# Altium schematic sheet AIRZAI_NFC_READER_FLEX.SchDoc
size A3
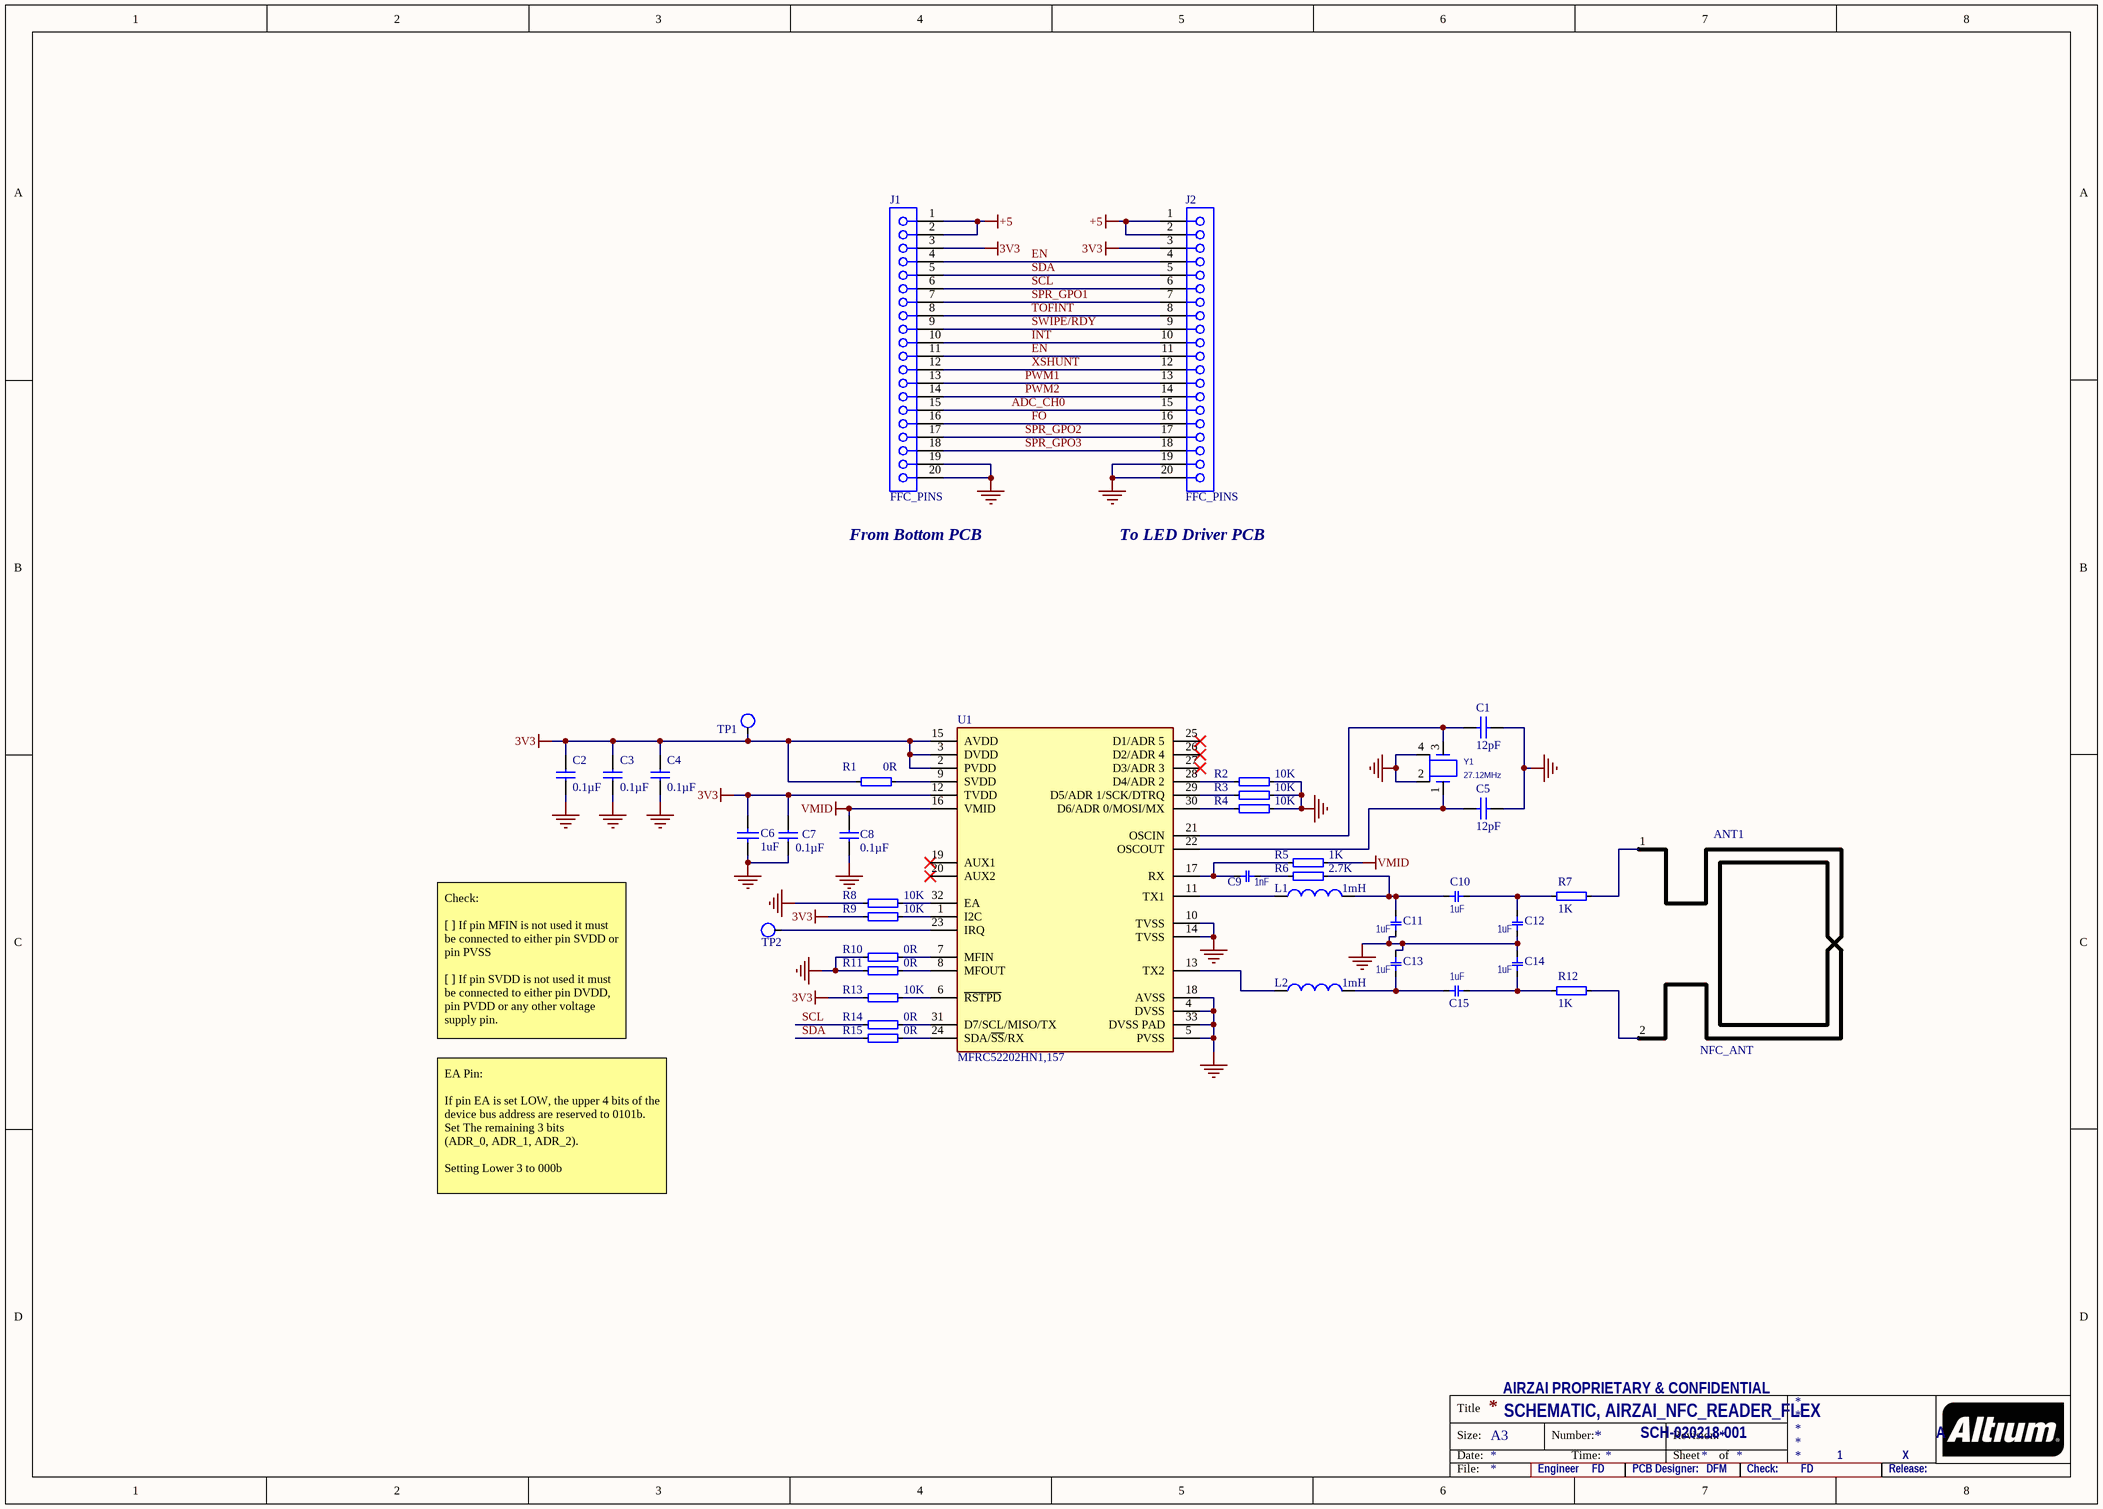
[diagram p0: AIRZAI_NFC_READER_FLEX.SchDoc]

## Parts
ANT1  NFC_ANT
C1  12pF
C2  0.1µF  [0402CAP]
C3  0.1µF  [0402CAP]
C4  0.1µF  [0402CAP]
C5  12pF
C6  1uF  [CAPC0402(1005)60_M]
C7  0.1µF  [0402CAP]
C8  0.1µF  [0402CAP]
C9  1nF  [0603]
C10  1uF  [0603]
C11  1uF  [0603]
C12  1uF  [0603]
C13  1uF  [0603]
C14  1uF  [0603]
C15  1uF  [0603]
J1  FFC_PINS
J2  FFC_PINS
L1  1mH  [0402-A]
L2  1mH  [0402-A]
R1  0R  [0402]
R2  10K  [0402]
R3  10K  [0402]
R4  10K  [0402]
R5  1K  [0402]
R6  2.7K  [0402]
R7  1K
R8  10K  [0402]
R9  10K  [0402]
R10  0R  [0402]
R11  0R  [0402]
R12  1K
R13  10K  [0402]
R14  0R  [0402]
R15  0R  [0402]
TP1  WIREPT  [TP_0.9MM]  (value not drawn)
TP2  WIREPT  [TP_0.9MM]  (value not drawn)
U1  Part Number: MFRC52202HN1,157  [NXP_SOT617-1_0]  (hidden comment: MFRC52201HN1,157)
Y1  27.12MHz  [XTAL_2016]

## Nets
3V3: C2.1 C3.1 C4.1 C6.2 C7.1 J1.3 J2.3 R1.2 R9.2 R13.2 TP1.1 U1.2(PVDD) U1.3(DVDD) U1.12(TVDD) U1.15(AVDD)
+5: J1.1 J1.2 J2.1 J2.2
GND: C1.1 C2.2 C3.2 C4.2 C5.1 C6.1 C7.2 C8.2 C11.1 C12.1 C13.2 C14.2 J1.19 J1.20 J2.19 J2.20 R2.1 R3.1 R4.1 R8.2 R10.2 R11.2 U1.4(DVSS) U1.5(PVSS) U1.10(TVSS) U1.14(TVSS) U1.18(AVSS) U1.33(DVSS_PAD) Y1.2 Y1.4
VMID: C8.1 R5.1 U1.16(VMID)
ADC_CH0: J1.15 J2.15
EN: J1.4 J1.11 J2.4 J2.11
FO: J1.16 J2.16
INT: J1.10 J2.10
PWM1: J1.13 J2.13
PWM2: J1.14 J2.14
SCL: J1.6 J2.6 R14.2
SDA: J1.5 J2.5 R15.2
SPR_GPO1: J1.7 J2.7
SPR_GPO2: J1.17 J2.17
SPR_GPO3: J1.18 J2.18
SWIPE/RDY: J1.9 J2.9
TOFINT: J1.8 J2.8
XSHUNT: J1.12 J2.12
NetANT1_1: ANT1.1 R7.1
NetANT1_2: ANT1.2 R12.1
NetC1_2: C1.2 U1.21(OSCIN) Y1.3
NetC5_2: C5.2 U1.22(OSCOUT) Y1.1
NetC9_1: C9.1 R6.2
NetC9_2: C9.2 R5.2 U1.17(RX)
NetC10_1: C10.1 C12.2 R7.2
NetC10_2: C10.2 C11.2 L1.2 R6.1
NetC13_1: C13.1 C15.2 L2.2
NetC14_1: C14.1 C15.1 R12.2
NetL1_1: L1.1 U1.11(TX1)
NetL2_1: L2.1 U1.13(TX2)
NetR1_1: R1.1 U1.9(SVDD)
NetR2_2: R2.2 U1.28(D4/ADR_2)
NetR3_2: R3.2 U1.29(D5/ADR_1/SCK/DTRQ)
NetR4_2: R4.2 U1.30(D6/ADR_0/MOSI/MX)
NetR8_1: R8.1 U1.32(EA)
NetR9_1: R9.1 U1.1(I2C)
NetR10_1: R10.1 U1.7(MFIN)
NetR11_1: R11.1 U1.8(MFOUT)
NetR13_1: R13.1 U1.6(~{RSTPD})
NetR14_1: R14.1 U1.31(D7/SCL/MISO/TX)
NetR15_1: R15.1 U1.24(SDA/~{SS}/RX)
NetTP2_1: TP2.1 U1.23(IRQ)

Not connected (* = marked no-connect by the designer): U1 19(AUX1)* 20(AUX2)* 25(D1/ADR_5)* 26(D2/ADR_4)* 27(D3/ADR_3)*

## Notes on the sheet
- (near J1) From Bottom PCB
- (near J2) To LED Driver PCB
- Check:
  [ ] If pin MFIN is not used it must be connected to either pin SVDD or pin PVSS
  [ ] If pin SVDD is not used it must be connected to either pin DVDD, pin PVDD or any other voltage supply pin.
- EA Pin:
  If pin EA is set LOW, the upper 4 bits of the device bus address are reserved to 0101b. Set The remaining 3 bits
  (ADR_0, ADR_1, ADR_2).
  Setting Lower 3 to 000b
- AIRZAI PROPRIETARY & CONFIDENTIAL
- SCHEMATIC, AIRZAI_NFC_READER_FLEX
- SCH-020218-001
- 1
- X
- A
- Engineer
- FD
- PCB Designer:
- DFM
- Check:
- Release:
- Title
- Size:
- Date:
- A3
- Number:
- Time:
- Revision:
- Sheet
- of
- File:

## Library data of the parts
C1 C5 = CAP: CAP CER 12PF 50V C0G/NP0 0402; Manufacturer: KEMET; Manufacturer Part Number: C0402C120J5GACTU; Dielectric Material: Ceramic; Tolerance: 5%; Dielectric: C0G; Temperature Coefficient: 30ppm/°C; Value: 12pF; ComponentLink1URL: https://www.yuden.co.jp/productdata/catalog/mlcc01_e.pdf?src-supplier=Digi-Key; ComponentLink1Description: https://www.yuden.co.jp/productdata/catalog/mlcc01_e.pdf?src-supplier=Digi-Key; ComponentLink2URL: http://www.onlinecomponents.com/productFiles/mf-TAI/964emk105bj105kv-f.pdf?src-supplier=Onlinecomponents.com; ComponentLink2Description: http://www.onlinecomponents.com/productFiles/mf-TAI/964emk105bj105kv-f.pdf?src-supplier=Onlinecomponents.com; ComponentLink3URL: http://www.farnell.com/datasheets/2091854.pdf?src-supplier=Element14; ComponentLink3Description: http://www.farnell.com/datasheets/2091854.pdf?src-supplier=Element14; ComponentLink4URL: https://www.verical.com/server-webapp/html/getDatasheet?partID=638287&src-supplier=Verical; ComponentLink4Description: https://www.verical.com/server-webapp/html/getDatasheet?partID=638287&src-supplier=Verical; ComponentLink5URL: http://ds.yuden.co.jp/TYCOMPAS/ut/detail.do?productNo=EMK105BJ105KV-F&fileName=EMK105BJ105KV-F_SS&mode=specSheetDownload&src-supplier=Mouser; ComponentLink5Description: http://ds.yuden.co.jp/TYCOMPAS/ut/detail.do?productNo=EMK105BJ105KV-F&fileName=EMK105BJ105KV-F_SS&mode=specSheetDownload&src-supplier=Mouser; ComponentLink6URL: http://www.farnell.com/datasheets/1497285.pdf?src-supplier=Element14; ComponentLink6Description: http://www.farnell.com/datasheets/1497285.pdf?src-supplier=Element14; Supplier 1: Digi-Key; Supplier Part Number 1: 399-1013-6-ND; Stock 1: 1653435; Pricing 1: 1=0.1, 10=0.055, 100=0.0243, 500=0.01738, 1000=0.01366, 2500=0.01242, 5000=0.01143 (USD); Mount: Surface Mount,PCB; Case/Package: 0402; Number of Pins: 2; Case Code (Metric): 1005; Case Code (Imperial): 0402; Min Operating Temperature: -55°C; Max Operating Temperature: 125°C; Capacitance: 12pF; Voltage Rating: 50V; Voltage Rating (DC): 50V; Packaging: Tape and Reel; Package Quantity: 1; Termination: SMD/SMT; Voltage: 50V; Length: 1mm; Height: 0.5mm; Width: 0.02inch; Thickness: 0.022inch; Lead Pitch: 0.3mm; Depth: 0.5mm; Radiation Hardening: No; REACH SVHC: No SVHC; Lead Free: Lead Free; ComponentLink7URL: http://www.farnell.com/datasheets/2119935.pdf?src-supplier=Element14; ComponentLink7Description: http://www.farnell.com/datasheets/2119935.pdf?src-supplier=Element14; ComponentLink8URL: http://www.farnell.com/datasheets/2740746.pdf?src-supplier=Newark; ComponentLink8Description: http://www.farnell.com/datasheets/2740746.pdf?src-supplier=Newark; ComponentLink9URL: http://www.mouser.com/ds/2/212/KEM_C1003_C0G_SMD-1101588.pdf?src-supplier=Mouser; ComponentLink9Description: http://www.mouser.com/ds/2/212/KEM_C1003_C0G_SMD-1101588.pdf?src-supplier=Mouser; ComponentLink10URL: https://www.alliedelec.com/m/d/9bfe7773041ffe9d406e68bc7b377fdd.pdf?src-supplier=Allied+Electronics; ComponentLink10Description: https://www.alliedelec.com/m/d/9bfe7773041ffe9d406e68bc7b377fdd.pdf?src-supplier=Allied+Electronics
C2-C4 C7 C8 = C0402-100n: Capacitor, X7R, ±10%; Manufacturer: TDK; Manufacturer Part Number: C1005X7R1C104K; Note: 16V ±10% X7R; Case-EIA: 0402; Case-Metric: 1005; Rated Voltage: 16 V; Tolerance: Â±20%; Datasheet: *; Footprint: 0402; Pin Count: 2; Value: 0.1µF; Supplier: *; Supplier part number: *; 2nd source Supplier: *; 2nd source part number: *; Max Thickness: 0.6 mm; Supplier 1: Digi-Key; Supplier Part Number 1: 445-4952-2-ND; Technology: SMT
C6 = CAP: CAP 1uF 16V ±10% 0402 (1005 Metric) Thickness 0.6mm SMD; Manufacturer: Taiyo Yuden; Manufacturer Part Number: EMK105BJ105KV-F; Dielectric: X5R; Value: 1uF; Supplier 1: Digi-Key; Supplier Part Number 1: 587-2477-6-ND; Stock 1: 1414379; Pricing 1: 1=0.1, 10=0.076, 100=0.0337, 500=0.02406, 1000=0.01891, 2500=0.01719, 5000=0.01581 (USD); Mount: Surface Mount; Case/Package: 0402; Number of Pins: 2; Case Code (Metric): 1005; Case Code (Imperial): 0402; Min Operating Temperature: -55°C; Max Operating Temperature: 85°C; Capacitance: 1uF; Tolerance: 10%; Packaging: Tape and Reel; Voltage Rating (DC): 16V; Package Quantity: 1; Voltage Rating: 16V; Termination: SMD/SMT; Length: 1mm; Height: 0.5mm; Width: 0.02inch; Thickness: 0.022inch; Depth: 0.5mm; Radiation Hardening: No; REACH SVHC: Unknown; Halogen Free: Halogen Free; ComponentLink1URL: https://www.yuden.co.jp/productdata/catalog/mlcc01_e.pdf?src-supplier=Digi-Key; ComponentLink1Description: https://www.yuden.co.jp/productdata/catalog/mlcc01_e.pdf?src-supplier=Digi-Key; ComponentLink2URL: http://www.onlinecomponents.com/productFiles/mf-TAI/964emk105bj105kv-f.pdf?src-supplier=Onlinecomponents.com; ComponentLink2Description: http://www.onlinecomponents.com/productFiles/mf-TAI/964emk105bj105kv-f.pdf?src-supplier=Onlinecomponents.com; ComponentLink3URL: http://www.farnell.com/datasheets/2091854.pdf?src-supplier=Element14; ComponentLink3Description: http://www.farnell.com/datasheets/2091854.pdf?src-supplier=Element14; ComponentLink4URL: https://www.verical.com/server-webapp/html/getDatasheet?partID=638287&src-supplier=Verical; ComponentLink4Description: https://www.verical.com/server-webapp/html/getDatasheet?partID=638287&src-supplier=Verical; ComponentLink5URL: http://ds.yuden.co.jp/TYCOMPAS/ut/detail.do?productNo=EMK105BJ105KV-F&fileName=EMK105BJ105KV-F_SS&mode=specSheetDownload&src-supplier=Mouser; ComponentLink5Description: http://ds.yuden.co.jp/TYCOMPAS/ut/detail.do?productNo=EMK105BJ105KV-F&fileName=EMK105BJ105KV-F_SS&mode=specSheetDownload&src-supplier=Mouser; ComponentLink6URL: http://www.farnell.com/datasheets/1497285.pdf?src-supplier=Element14; ComponentLink6Description: http://www.farnell.com/datasheets/1497285.pdf?src-supplier=Element14
C9-C15 = 56p
  C9: VALUE: 1nF
  C10-C15: VALUE: 1uF
L1 L2 = Inductor: Value: 1mH
R1 R10 R11 R14 R15 = R0402-12k: Resistor, ±1%, 0.063W; Manufacturer: Panasonic; Manufacturer Part Number: ERJ-2GE0R00X; Note: 0.1W JUMPER; Case-Metric: 1005; Tolerance: ±5%; Datasheet: *; Pin Count: 2; Value: 0R; 2nd source Supplier: *; 2nd source part number: *; Case-EIA: 0402; Max Thickness: 0.6mm; Supplier 1: Digi-Key; Supplier Part Number 1: P0.0JTR-ND; Technology: SMT
R2-R4 R8 R9 R13 = R0402-12k: Resistor 10K, ±1%, 0.063W; Manufacturer: Vishay Dale; Manufacturer Part Number: CRCW040210K0JNED; Resistance: 10kR; Power Rating: 63mW; Tolerance: 5%; Voltage Rating: 50V; Temperature Coefficient: 200ppm/°C; Value: 10K; Supplier 1: Digi-Key; Supplier Part Number 1: 541-10KJDKR-ND; Stock 1: 2; Pricing 1: 1=0.1, 10=0.034, 100=0.0138, 1000=0.00618, 2500=0.00536, 5000=0.00443 (USD); Mount: Surface Mount; Case/Package: 0402; Weight: 2.3E-05oz; Case Code (Imperial): 0402; Case Code (Metric): 1005; Contact Plating: Tin; Min Operating Temperature: -55°C; Max Operating Temperature: 155°C; Packaging: Tape and Reel; Package Quantity: 1; Termination: SMD/SMT; Composition: Thick Film; Number of Terminations: 2; Military Standard: Not; Max Power Dissipation: 63mW; Features: Automotive AEC-Q200; Length: 1mm; Height: 0.016inch; Width: 0.5mm; Depth: 0.5mm; Radiation Hardening: No; REACH SVHC: Unknown; ComponentLink1URL: http://www.vishay.com/docs/20035/dcrcwe3.pdf?src-supplier=Digi-Key; ComponentLink1Description: http://www.vishay.com/docs/20035/dcrcwe3.pdf?src-supplier=Digi-Key; ComponentLink2URL: http://www.farnell.com/datasheets/2045673.pdf?src-supplier=Element14; ComponentLink2Description: http://www.farnell.com/datasheets/2045673.pdf?src-supplier=Element14; ComponentLink3URL: https://www.alliedelec.com/m/d/0c934d6939ccefa68dbe0b96d821c8cf.pdf?src-supplier=Allied+Electronics; ComponentLink3Description: https://www.alliedelec.com/m/d/0c934d6939ccefa68dbe0b96d821c8cf.pdf?src-supplier=Allied+Electronics; ComponentLink4URL: http://www.vishay.com/docs/20035/dcrcwe3.pdf?src-supplier=Avnet; ComponentLink4Description: http://www.vishay.com/docs/20035/dcrcwe3.pdf?src-supplier=Avnet
R5 R7 R12 = R0402-12k: Resistor 1K, ±1%, 0.063W; Value: 1K
R6 = R0402-12k: Resistor 2.7K, ±1%, 0.063W; Value: 2.7K
U1 = MFRC52201HN1,157: IC RFID READER 13.56MHZ 32HVQFN; Manufacturer: NXP; Mfg Package Ident: SOT617-1; helpURL: https://upverter.com/upn/revision/969ab42917e1bb0e/; ComponentLink2Description: Datasheet; Temperature: -25°C to +85°C; Package: SOT617-1; Supplier 2: Mouser; Supplier 1: Digi-Key; ComponentLink1URL: https://upverter.com/upn/revision/969ab42917e1bb0e/; Supplier Part Number 2: 771-MFRC52202HN1157; Supplier Part Number 1: MFRC52202HN1,157-ND; ComponentLink1Description: Upverter; ComponentLink2URL: https://media.digikey.com/pdf/Data%20Sheets/NXP%20PDFs/MFRC522.pdf; RoHS: TRUE; Mouser Part Number: 771-MFRC52202HN1157; Temperature Range High: +85°C; Digikey Description: IC READER 32-HVQFN; Digikey Part Number: MFRC52202HN1,157-ND; Lead Free: yes; Temperature Range Low: -25°C; Value: MFRC52201HN1,157
Y1 = ZTB_2: CRYSTAL 27.12MHZ 10PF SMD; Manufacturer: ECS International; Manufacturer Part Number: ECS-271.2-10-37-CKM-TR; Description: Crystal 27.12MHz ±10ppm (Tol) ±10ppm (Stability) 10pF FUND 60Ohm 4-Pin Mini-CSMD T/R; Value: 27.12MHz; ComponentLink1URL: http://www.murata.com/products/catalog/pdf/p79e.pdf; ComponentLink1Description: http://www.murata.com/products/catalog/pdf/p79e.pdf; Supplier 1: Digi-Key; Supplier Part Number 1: XC2511DKR-ND; Stock 1: 1000; Pricing 1: 1=0.74, 10=0.613, 50=0.552, 100=0.4906, 500=0.46608 (USD)
J1 J2 = FFC_PINS: ComponentLink1URL: http://www.molex.com/molex/index.jsp; ComponentLink2URL: http://www.molex.com/webdocs/datasheets/pdf/en-us/0528922033_FFC_FPC_CONNECTORS.pdf; ComponentLink3Description: Package Specification; ComponentLink3URL: http://www.molex.com/pdm_docs/sd/528922033_sd.pdf; ComponentLink1Description: Manufacturer URL